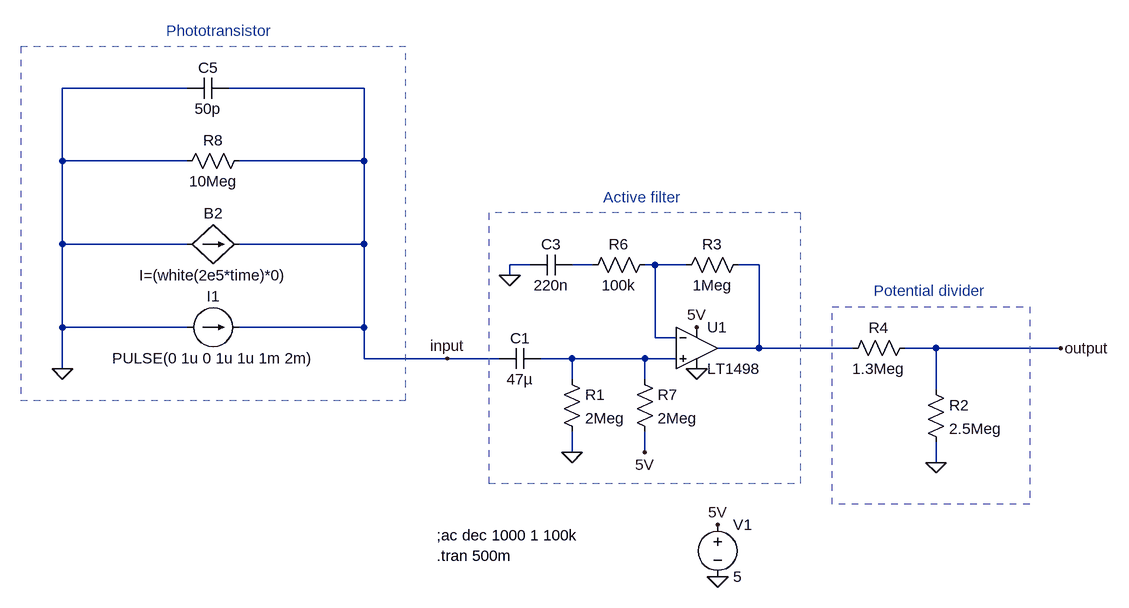
[diagram p0: schematic IR v1.3.asc]
IR v1.3.asc, the LTspice schematic file:
Version 4
SHEET 1 1152 680
WIRE -720 -416 -912 -416
WIRE -448 -416 -656 -416
WIRE -912 -304 -912 -416
WIRE -720 -304 -912 -304
WIRE -448 -304 -448 -416
WIRE -448 -304 -640 -304
WIRE -912 -176 -912 -304
WIRE -720 -176 -912 -176
WIRE -448 -176 -448 -304
WIRE -448 -176 -640 -176
WIRE -192 -144 -224 -144
WIRE -96 -144 -128 -144
WIRE 0 -144 -16 -144
WIRE 48 -144 0 -144
WIRE 160 -144 128 -144
WIRE -224 -128 -224 -144
WIRE -912 -48 -912 -176
WIRE -720 -48 -912 -48
WIRE -448 -48 -448 -176
WIRE -448 -48 -640 -48
WIRE 0 -32 0 -144
WIRE 32 -32 0 -32
WIRE 160 -16 160 -144
WIRE 160 -16 96 -16
WIRE 304 -16 160 -16
WIRE 432 -16 384 -16
WIRE 624 -16 432 -16
WIRE -448 0 -448 -48
WIRE -320 0 -448 0
WIRE -240 0 -320 0
WIRE -128 0 -176 0
WIRE -16 0 -128 0
WIRE 32 0 -16 0
WIRE -912 16 -912 -48
WIRE -128 32 -128 0
WIRE -16 32 -16 0
WIRE 432 48 432 -16
WIRE -128 144 -128 112
WIRE -16 144 -16 112
WIRE 432 160 432 128
FLAG 96 336 0
FLAG 96 256 5V
FLAG 64 -48 5V
FLAG 64 16 0
FLAG 624 -16 output
FLAG -128 144 0
FLAG -16 144 5V
FLAG -320 0 input
FLAG -912 16 0
FLAG -224 -128 0
FLAG 432 160 0
SYMBOL voltage 96 240 R0
WINDOW 123 0 0 Left 0
WINDOW 39 0 0 Left 0
SYMATTR InstName V1
SYMATTR Value 5
SYMBOL OpAmps\\LT1498 64 -80 R0
SYMATTR InstName U1
SYMBOL cap -176 -16 R90
WINDOW 0 0 32 VBottom 2
WINDOW 3 32 32 VTop 2
SYMATTR InstName C1
SYMATTR Value 47µ
SYMBOL res -144 16 R0
SYMATTR InstName R1
SYMATTR Value 2Meg
SYMBOL res 144 -160 R90
WINDOW 0 0 56 VBottom 2
WINDOW 3 32 56 VTop 2
SYMATTR InstName R3
SYMATTR Value 1Meg
SYMBOL res 0 -160 R90
WINDOW 0 0 56 VBottom 2
WINDOW 3 32 56 VTop 2
SYMATTR InstName R6
SYMATTR Value 100k
SYMBOL res -32 16 R0
SYMATTR InstName R7
SYMATTR Value 2Meg
SYMBOL current -720 -48 R270
WINDOW 0 32 40 VTop 2
WINDOW 3 -32 40 VBottom 2
WINDOW 123 0 0 Left 0
WINDOW 39 0 0 Left 0
SYMATTR InstName I1
SYMATTR Value PULSE(0 1u 0 1u 1u 1m 2m)
SYMBOL bi -720 -176 R270
WINDOW 0 32 40 VTop 2
WINDOW 3 -32 40 VBottom 2
SYMATTR InstName B2
SYMATTR Value I=(white(2e5*time)*0)
SYMBOL res -624 -320 R90
WINDOW 0 0 56 VBottom 2
WINDOW 3 32 56 VTop 2
SYMATTR InstName R8
SYMATTR Value 10Meg
SYMBOL cap -656 -432 R90
WINDOW 0 0 32 VBottom 2
WINDOW 3 32 32 VTop 2
SYMATTR InstName C5
SYMATTR Value 50p
SYMBOL cap -128 -160 R90
WINDOW 0 0 32 VBottom 2
WINDOW 3 32 32 VTop 2
SYMATTR InstName C3
SYMATTR Value 220n
SYMBOL res 400 -32 R90
WINDOW 0 0 56 VBottom 2
WINDOW 3 32 56 VTop 2
SYMATTR InstName R4
SYMATTR Value 1.3Meg
SYMBOL res 416 32 R0
SYMATTR InstName R2
SYMATTR Value 2.5Meg
TEXT -752 -504 Left 2 ;Phototransistor
TEXT -80 -248 Left 2 ;Active filter
TEXT -336 272 Left 2 !;ac dec 1000 1 100k\n.tran 500m
TEXT 336 -104 Left 2 ;Potential divider
RECTANGLE Normal -976 64 -384 -480 2
RECTANGLE Normal 224 -224 -256 192 2
RECTANGLE Normal 576 224 272 -80 2

The netlist it stands for:
* IR v1.3.asc
V1 5V 0 5
XU1 N004 N002 5V 0 N003 LT1498  ; pins In+ In- V+ V- OUT
C1 N004 input 47µ
R1 N004 0 2Meg
R3 N003 N002 1Meg
R6 N002 N001 100k
R7 N004 5V 2Meg
I1 0 input PULSE(0 1u 0 1u 1u 1m 2m)
B2 0 input I=(white(2e5*time)*0)
R8 input 0 10Meg
C5 input 0 50p
C3 N001 0 220n
R4 output N003 1.3Meg
R2 output 0 2.5Meg
* Phototransistor
* Active filter
;ac dec 1000 1 100k
.tran 500m
* Potential divider
.lib LTC.lib
.backanno
.end